# EAGLE design USB-to-ESP-UART_v3.1 (EAGLE 9.6.2)
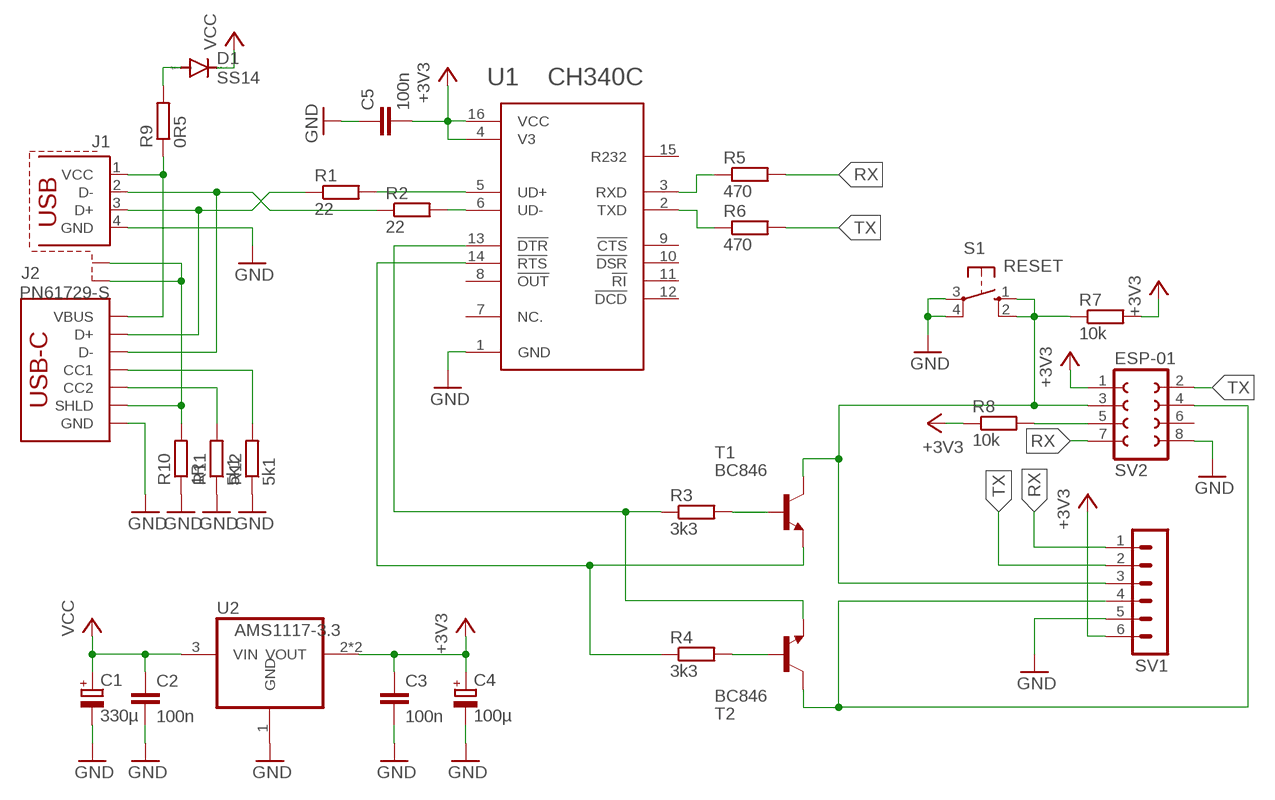
[diagram p0: schematic, sheet 1]

## Parts
C1  330µ  CPOL-EUE2.5-7  [E2,5-7]
C2  100n  C-EUC1206  [C1206]
C3  100n  C-EUC1206  [C1206]
C4  100µ  CPOL-EUE2.5-5  [E2,5-5]
C5  100n  C-EUC1206  [C1206]
D1  SS14  DIODE-DO214AC  [DO214AC]
J1  PN61729-S  [PN61729-S]
J2  USB_C_2-LAYER_PADS  [USB-C-16P-2LAYER-PADS]
R1  22  R-EU_R1206  [R1206]
R2  22  R-EU_R1206  [R1206]
R3  3k3  R-EU_R1206  [R1206]
R4  3k3  R-EU_R1206  [R1206]
R5  470  R-EU_R1206  [R1206]
R6  470  R-EU_R1206  [R1206]
R7  10k  R-EU_R1206  [R1206]
R8  10k  R-EU_R1206  [R1206]
R9  0R5  R-EU_R1206  [R1206]
R10  1R  R-EU_R1206  [R1206]
R11  5k1  R-EU_R1206  [R1206]
R12  5k1  R-EU_R1206  [R1206]
S1  RESET  10-XX  [B3F-10XX]
SV1  MA06-1  [MA06-1]
SV2  ESP-01  FE04-2CLEAN  [FE04-2-CL]
T1  BC846  BC846A-NPN-SOT23-BEC  [SOT23-BEC]
T2  BC846  BC846A-NPN-SOT23-BEC  [SOT23-BEC]
U1  CH340C  [SOIC127P600X180-16N]
U2  AMS1117-3.3  REG1117  [SOT223]

## Nets
+3V3: C3.1 C4.+ C5.2 R7.2 R8.1 SV1.6 SV2.1 U1.4(V3) U1.16(VCC) U2.2(VOUT) U2.4(VOUT)
GND: C1.- C2.2 C3.2 C4.- C5.1 J1.4(GND) J2.GND J2.GND2(GND) R10.1 R11.1 R12.1 S1.3(P) S1.4(P1) SV1.5 SV2.8 U1.1(GND) U2.1(GND)
N$1: R3.2 T1.B
N$2: R4.2 T2.B
N$3: R3.1 T2.E U1.13(!DTR)
N$4: R4.1 T1.E U1.14(!RTS)
N$5: R5.1 U1.3(RXD)
N$6: R6.1 U1.2(TXD)
N$7: R1.2 U1.5(UD+)
N$8: R2.2 U1.6(UD-)
N$9: R7.1 S1.1(S) S1.2(S1) SV1.3 SV2.3 T1.C
N$10: J2.B5(CC2) R11.2
N$11: SV1.4 SV2.4 T2.C
N$12: J1.S1 J1.S2 J2.SHLD1(SHLD) J2.SHLD2(SHLD) J2.SHLD3(SHLD) J2.SHLD4(SHLD) R10.2
N$13: J2.A5(CC1) R12.2
N$14: J1.2(D-) J2.A7(D-) J2.B7(D-) R2.1
N$15: J1.3(D+) J2.A6(D+) J2.B6(D+) R1.1
N$16: J1.1(VCC) J2.VBUS1(VBUS) J2.VBUS2(VBUS) R9.1
N$19: R8.2 SV2.5
N$20: D1.A R9.2
RX: R5.2 SV1.1 SV2.7
TX: R6.2 SV1.2 SV2.2
VCC: C1.+ C2.1 D1.C U2.3(VIN)
Unconnected: SV2.6 U1.7(NC.) U1.8(!OUT) U1.9(!CTS) U1.10(!DSR) U1.11(!RI) U1.12(!DCD) U1.15(R232)

## Library data of the parts
C1 C4 = rcl-custom:CPOL-EU: POLARIZED CAPACITOR, European symbol; SPICEPREFIX: C
C2 C3 C5 = rcl-custom:C-EU: CAPACITOR, European symbol; SPICEPREFIX: C
D1 = diode-custom:DIODE-: DIODE
J1 = con-berg-custom:PN61729-S: BERG USB connector; OC_FARNELL: unknown; OC_NEWARK: unknown
J2 = SparkFun-Connectors-custom:USB_C: USB Type C 16Pin Connector Super Speed pins not available on the 16-pin purely SMD connector so this part is best for USB 2.0 implementations. D1 and D2 are tied together enabling D+/- no matter which way the cable is plugged into the connector. The two channel configuration pins (CC1/2) are exposed. These are normally connected to ground via 5.1k resistors but can be reconfigured for high current/high power applications. **4-LAYER BOARD WARNING!!** If designing 4-layer board, make sure to select the variant _4-LAYER-ISOLATED. The linked footprint (USB-C-16-4LAYER-ISOLATED) includes some very necessary cutout polygons in the inner layers (2 and 15). This prevents the PTH mounting shield legs on the USB connector from electrically connecting any other polygons on the inner layers (usually VCC and GND).; PROD_ID: CONN-14122
R1-R12 = rcl-custom:R-EU_: RESISTOR, European symbol; SPICEPREFIX: R
S1 = switch-omron:10-XX: OMRON SWITCH; MPN: B3F-1000; OC_FARNELL: 176432; OC_NEWARK: 36M3542
SV1 = con-lstb-custom:MA06-1: PIN HEADER; OC_FARNELL: unknown; OC_NEWARK: unknown
SV2 = con-lsta-custom:FE04-2: FEMALE HEADER
T1 T2 = transistor-custom:*-NPN-: NPN Transistror BF959 corrected 2008.03.06
U1 = CH340C:CH340C: USB to serial chip CH340 Check availability <https://pricing.snapeda.com/parts/CH340C/WCH/view-part?ref=eda>; AVAILABILITY: Not in stock; DESCRIPTION: USB to serial chip CH340; MF: WCH; MP: CH340C; PACKAGE: None; PRICE: None
U2 = burr-brown-custom:REG1117: 800mA and 1A Low Dropout (LDO) Positive Regulator 1.8V, 2.5V, 2.85V, 3.3V, 5V, and Adj; MPN: REG1117; OC_FARNELL: 1097566; OC_NEWARK: 14P6981

## Board
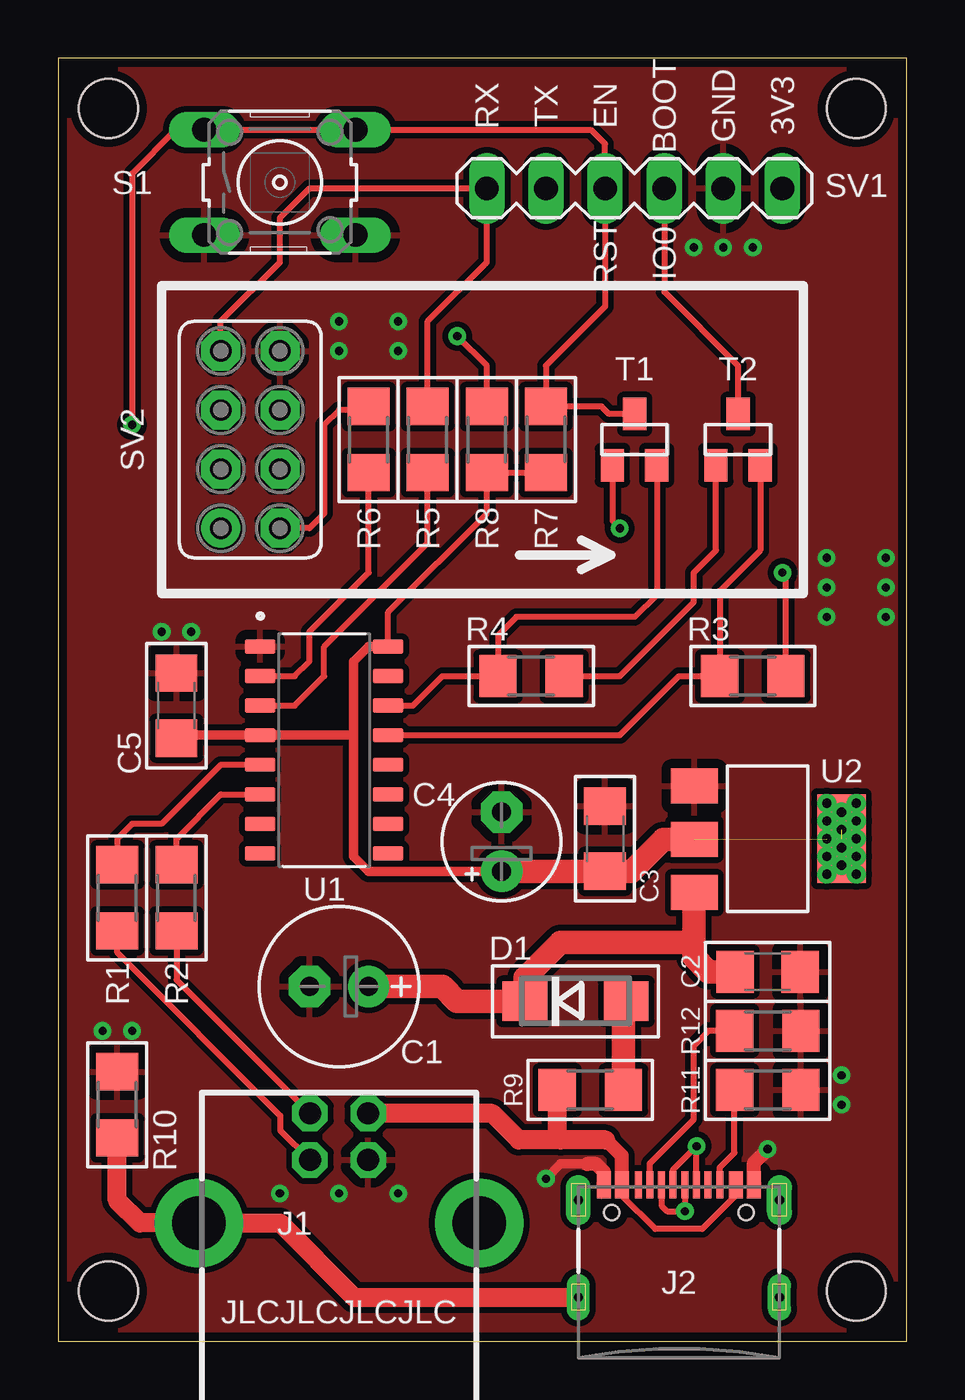
[diagram p1: board, top side]
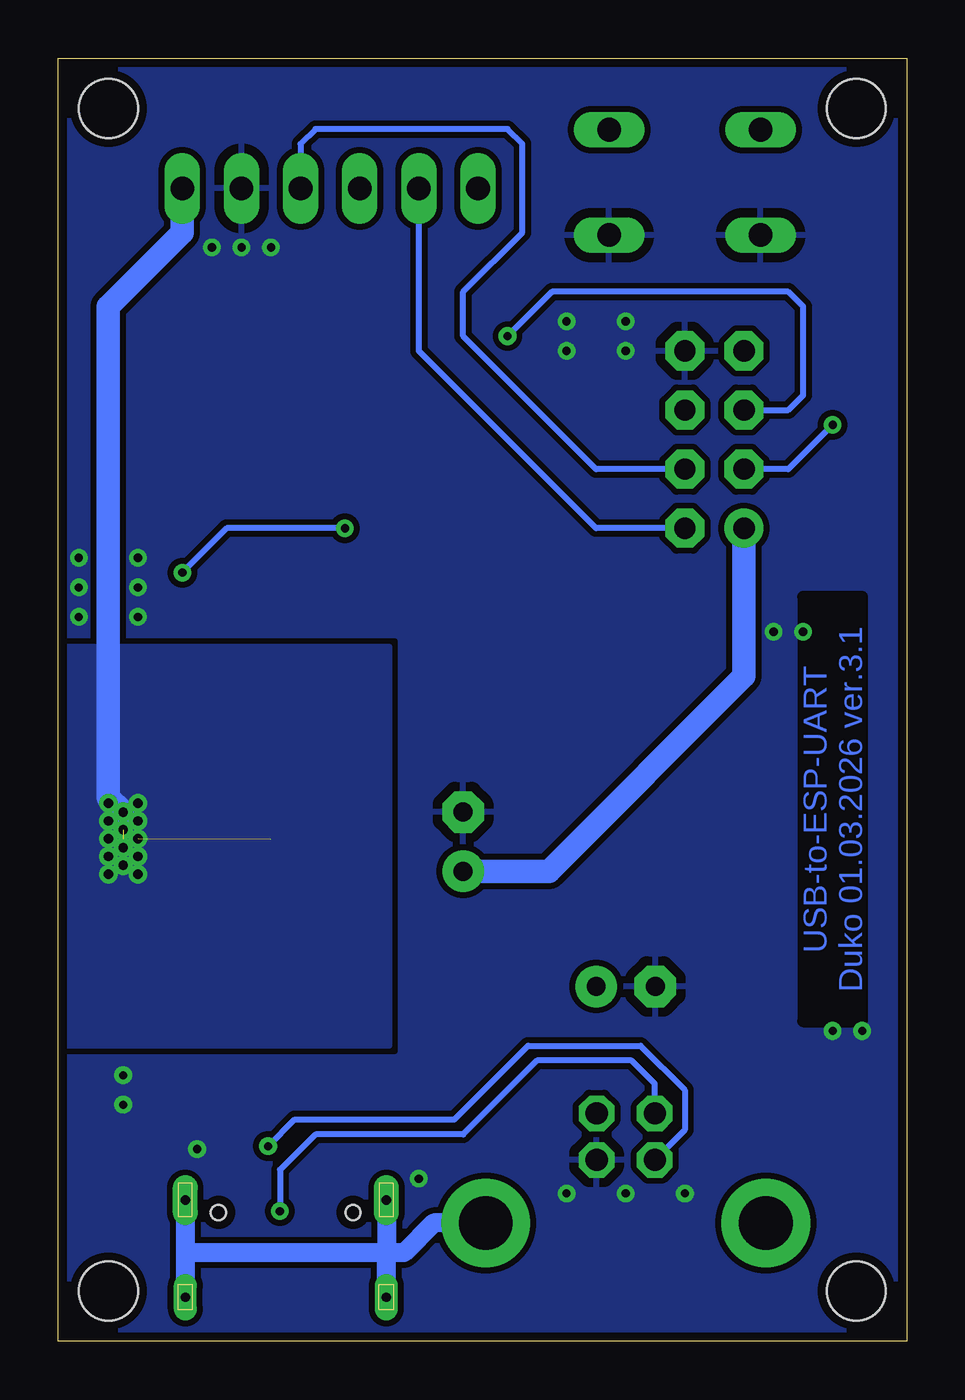
[diagram p2: board, bottom side, seen from below]

Size 36.45 x 55.12 mm. Coordinates in mm from the lower left corner, seen from the top.
Outline: 0,0 36.45,0 36.45,55.12 0,55.12 0,0
Copper layers (1*16): Top 0.035mm / dielectric 1.5mm / Bottom 0.035mm
Design rules "default *": minimum track width 6mil, minimum drill 0.35mm, track to track 6mil, track to pad 6mil, pad to pad 6mil, via to via 6mil, smd to smd 6mil, copper to edge 15mil, drill to drill 6mil, minimum pad ring 10mil, minimum via ring 8mil, stop-mask expansion 4mil, vias tented up to drill 14mil, thermal gap 16mil
Holes 2.54 mm at 2.16,2.16 34.29,2.16 2.16,52.96 34.29,52.96

### Footprints (pad centres in the part's own frame; a part is rotated, then mirrored left to right if it is on the bottom)
E2,5-7 = drill 0.813 pad 1.778: + -1.27,0 | drill 0.813 pad 1.778 octagon: - 1.27,0
C1206 = smd 1.6 x 1.8: 1 -1.4,0; 2 1.4,0
E2,5-5 = drill 0.813 pad 1.778: + -1.27,0 | drill 0.813 pad 1.778 octagon: - 1.27,0
DO214AC = smd 1.927 x 1.7: A 2.177,0; C -2.177,0
PN61729-S = drill 0.95 pad 1.524 octagon: 1 1.25,4.71; 2 -1.25,4.71; 3 -1.25,2.71; 4 1.25,2.71 | drill 2.3 pad 3.81: S1 -6.02,0; S2 6.02,0
USB-C-16P-2LAYER-PADS = smd 0.3 x 1.152: A5 -1.25,-0.264; A6 -0.25,-0.264; A7 0.25,-0.264; A8 1.25,-0.264; B5 1.75,-0.264; B6 0.75,-0.264; B7 -0.75,-0.264; B8 -1.75,-0.264 | smd 0.6 x 1.152: GND -3.225,-0.264; GND2 3.225,-0.264; VBUS1 -2.45,-0.264; VBUS2 2.45,-0.264 | drill 0.4 pad 1.067 long: SHLD1 -4.318,-0.915; SHLD2 4.318,-0.915 | drill 0.4 pad 0.991 long: SHLD3 -4.318,-5.095; SHLD4 4.318,-5.095 | hole 0.65: -2.89,-1.445; 2.89,-1.445
R1206 = smd 1.6 x 1.803: 1 -1.422,0; 2 1.422,0
B3F-10XX = drill 1.016 long: 1 -3.251,2.261; 2 3.251,2.261; 3 -3.251,-2.261; 4 3.251,-2.261
MA06-1 = drill 1.016 long: 1 -6.35,0; 2 -3.81,0; 3 -1.27,0; 4 1.27,0; 5 3.81,0; 6 6.35,0
FE04-2-CL = drill 0.914 pad 1.676: 1 -5.08,1.27 | drill 0.914 pad 1.676 octagon: 2 -5.08,-1.27; 3 -2.54,1.27; 4 -2.54,-1.27; 5 0,1.27; 6 0,-1.27; 7 2.54,1.27; 8 2.54,-1.27
SOT23-BEC = smd 1 x 1.4: B -0.95,-1.1; C 0,1.1; E 0.95,-1.1
SOIC127P600X180-16N = smd 1.31 x 0.62: 1 -2.75,4.445; 2 -2.75,3.175; 3 -2.75,1.905; 4 -2.75,0.635; 5 -2.75,-0.635; 6 -2.75,-1.905; 7 -2.75,-3.175; 8 -2.75,-4.445; 9 2.75,-4.445; 10 2.75,-3.175; 11 2.75,-1.905; 12 2.75,-0.635; 13 2.75,0.635; 14 2.75,1.905; 15 2.75,3.175; 16 2.75,4.445
SOT223 = smd 1.499 x 2.007: 1 -2.261,-3.15; 2 0.025,-3.15; 3 2.311,-3.15 | smd 3.81 x 2.083: 4 0,3.175

### Placement (x,y rotation side)
C1  12.06,15.24 180 top
C2  30.48,15.88 0 top
C3  23.5,21.59 90 top
C4  19.05,21.46 90 top
C5  5.08,27.3 270 top
D1  22.23,14.61 0 top
J1  12.06,5.08 0 top
J2  26.67,6.99 0 top
R1  2.54,19.05 90 top
R2  5.08,19.05 90 top
R3  29.84,28.57 0 top
R4  20.32,28.57 0 top
R5  15.88,38.73 90 top
R6  13.34,38.73 90 top
R7  20.95,38.73 270 top
R8  18.41,38.73 90 top
R9  22.86,10.79 0 top
R10  2.54,10.16 270 top
R11  30.48,10.79 180 top
R12  30.48,13.34 180 top
S1  9.53,49.78 0 top
SV1  24.77,49.53 0 top
SV2  8.26,40.01 90 top
T1  24.77,38.73 0 top
T2  29.21,38.73 0 top
U1  11.43,25.4 0 top
U2  30.48,21.59 270 top

### Tracks (layer width: path | path; a pad name or v marks a point on that pad's centre or on a via)
+3V3  (via drill 0.4)  (2 unrouted)
  Top 0.254: R7.2 R8.1 18.41,35.56 14.18,31.32 U1.16
  Top 0.406: 12.7,26.04 12.7,29.21 13.34,29.84 U1.16 | 12.7,26.04 12.06,26.04 U1.4 5.21,26.04 C5.2 | C4.+ 13.34,20.19 12.7,20.83 12.7,26.04
  Top 0.813: C3.1
  Top 1.016: C4.+ C3.1 | C3.1 24.64,20.19 26.01,21.57 U2.2
  Bottom 1.016: C4.+ 15.37,20.19 6.99,28.57 SV2.1 | SV1.6 31.11,47.62 34.29,44.45 34.29,23.37 v33.66,22.73
  other vias: 33.66,21.21 34.29,21.59 33.02,21.59 33.02,22.35 33.66,21.97 34.29,22.35 34.29,23.11 33.02,23.11 33.02,20.83 33.66,20.45 34.29,20.83 34.29,20.07 33.02,20.07
  pour Bottom (isolate 0.254): 22.23,29.84 22.23,12.7 36.2,12.7 36.2,29.84
GND  (via drill 0.35)
  Top 0.406: J2.GND 23.45,7.29 | 22.73,7.62 21.59,7.62 v20.95,6.99
  Top 0.61: 23.45,7.29 23.11,7.62 22.73,7.62 | J2.GND2 29.89,7.67 v30.48,8.26
  other vias: 29.84,46.99 28.57,46.99 27.3,46.99 12.06,43.81 12.06,42.55 14.61,43.81 14.61,42.55 5.71,30.48 4.45,30.48 1.91,13.34 3.17,13.34 33.66,11.43 33.66,10.16 35.56,31.11 35.56,32.38 35.56,33.66 33.02,31.11 33.02,32.38 33.02,33.66 9.53,6.35 14.61,6.35 12.06,6.35
  pour Bottom (isolate 0.254, rank 2): -1.91,57.02 -1.91,-1.91 38.1,-1.91 38.1,57.02
  pour Top (isolate 0.254): -3.81,58.93 -3.81,-3.81 40.01,-3.81 40.01,58.93
N$1  (via drill 0.35)
  Top 0.254: T1.B 23.82,35.24 v24.13,34.92 | R3.2 31.27,32.87 v31.11,33.02
  Bottom 0.254: v24.13,34.92 29.21,34.92 v31.11,33.02
N$2
  Top 0.254: R4.2 24.13,28.57 27.3,31.75 27.3,33.02 28.26,33.98 T2.B
N$3
  Top 0.254: U1.13 24.13,26.04 26.67,28.57 R3.1 28.42,32.23 30.16,33.97 T2.E
N$4
  Top 0.254: U1.14 15.24,27.3 16.51,28.57 R4.1 18.9,30.33 19.68,31.11 24.77,31.11 25.71,32.06 T1.E
N$5
  Top 0.254: U1.3 10.16,27.3 11.43,28.57 11.43,29.84 15.88,34.29 R5.1
N$6
  Top 0.254: R6.1 13.34,33.02 10.79,30.48 10.79,29.21 10.16,28.57 U1.2
N$7
  Top 0.254: U1.5 6.99,24.77 4.45,22.23 3.17,22.23 2.54,21.59 R1.2
N$8
  Top 0.254: R2.2 5.08,21.59 6.99,23.5 U1.6
N$9  (via drill 0.35)
  Top 0.254: T1.C 23.66,39.84 23.34,40.16 R7.1 20.95,41.91 23.5,44.45 SV1.3 23.5,51.44 22.89,52.05 S1.2 S1.1 5.05,52.05 3.17,50.16 v3.17,39.37
  Bottom 0.254: v3.17,39.37 5.08,37.47 SV2.3
N$10
  Top 0.254: J2.B5 28.42,7.46 29.06,8.1 R11.2
N$11
  Top 0.254: SV1.4 26.04,45.09 29.21,41.91 T2.C
  Bottom 0.254: SV2.4 13.34,37.47 19.05,43.18 19.05,45.09 16.51,47.62 16.51,51.44 17.14,52.07 25.4,52.07 26.04,51.44 SV1.4
N$12
  Top 0.813: R10.2 2.54,6.04 3.5,5.08 J1.S1 9.53,5.08 12.71,1.89 J2.SHLD3
  Bottom 0.813: J2.SHLD1 22.35,3.81 | J2.SHLD3 22.35,3.81 | J2.SHLD2 30.99,3.81 | 30.99,3.81 J2.SHLD4 | J1.S2 20.32,5.08 21.59,3.81 22.35,3.81 | 22.35,3.81 30.99,3.81
N$13
  Top 0.254: R12.2 27.94,13.34 27.3,12.7 27.3,9.53 25.42,7.64 J2.A5
N$14  (via drill 0.35)
  Top 0.254: J1.2 5.08,15.53 R2.1 | J2.A7 v26.92,5.59 26.16,5.59 25.92,5.83 J2.B7
  Bottom 0.254: J1.2 10.81,11.07 11.81,12.06 15.88,12.06 19.05,8.89 25.4,8.89 26.92,7.37 v26.92,5.59
N$15  (via drill 0.35)
  Top 0.254: J1.3 9.54,9.06 9.54,9.7 2.54,16.7 R1.1 | J2.B6 v27.42,8.37 | v27.42,8.37 26.42,7.37 J2.A6 | v27.42,8.37 v27.43,8.38
  Bottom 0.254: v27.43,8.38 26.29,9.53 19.43,9.53 16.26,12.7 11.43,12.7 9.53,10.79 9.53,9.08 J1.3
N$16
  Top 0.254: J2.VBUS2 29.12,6.28 27.67,4.83 25.65,4.83 24.22,6.26 J2.VBUS1
  Top 0.61: J2.VBUS1 24.22,6.66 24.22,7.97 23.53,8.65
  Top 0.813: 23.53,8.65 21.59,8.65 | 21.59,8.65 19.79,8.65 18.65,9.79 J1.1 | R9.1 21.44,8.8 21.59,8.65
N$19  (via drill 0.35)
  Top 0.254: R8.2 18.41,41.91 v17.14,43.18
  Bottom 0.254: SV2.5 5.08,40.01 4.45,40.64 4.45,44.45 5.08,45.09 15.24,45.09 v17.14,43.18
N$20
  Top 0.813: 24.28,14.48 D1.A
  Top 1.016: R9.2 24.28,14.48
RX
  Top 0.254: SV2.7 6.99,43.81 9.53,46.35 9.53,48.26 10.79,49.53 SV1.1 18.41,46.35 15.88,43.81 R5.2
TX
  Top 0.254: R6.2 13.18,40.01 12.06,40.01 11.43,39.37 11.43,35.56 10.79,34.92 SV2.2
  Bottom 0.254: SV2.2 13.34,34.92 20.95,42.55 SV1.2
VCC
  Top 0.813: 27.3,19.25 U2.3
  Top 1.016: C1.+ 16.51,15.24 17.14,14.61 D1.C 20.05,15.6 21.59,17.14 27.3,17.14 | 27.3,17.14 27.3,16.51 27.94,15.88 C2.1 | 27.3,17.14 27.3,19.25

### Text on the board
Bottom: USB-to-ESP-UART / Duko 01.03.2026 ver.3.1
tNames: RX | TX | EN | BOOT | GND | 3V3 | RST | IO0 | JLCJLCJLCJLC